# Altium schematic sheet LEDs.SchDoc
size A4; Organization: TU Darmstadt; Address1: IES; Address2: Merckstraße 25; Address3: 64283 Darmstadt; Address4: Germany
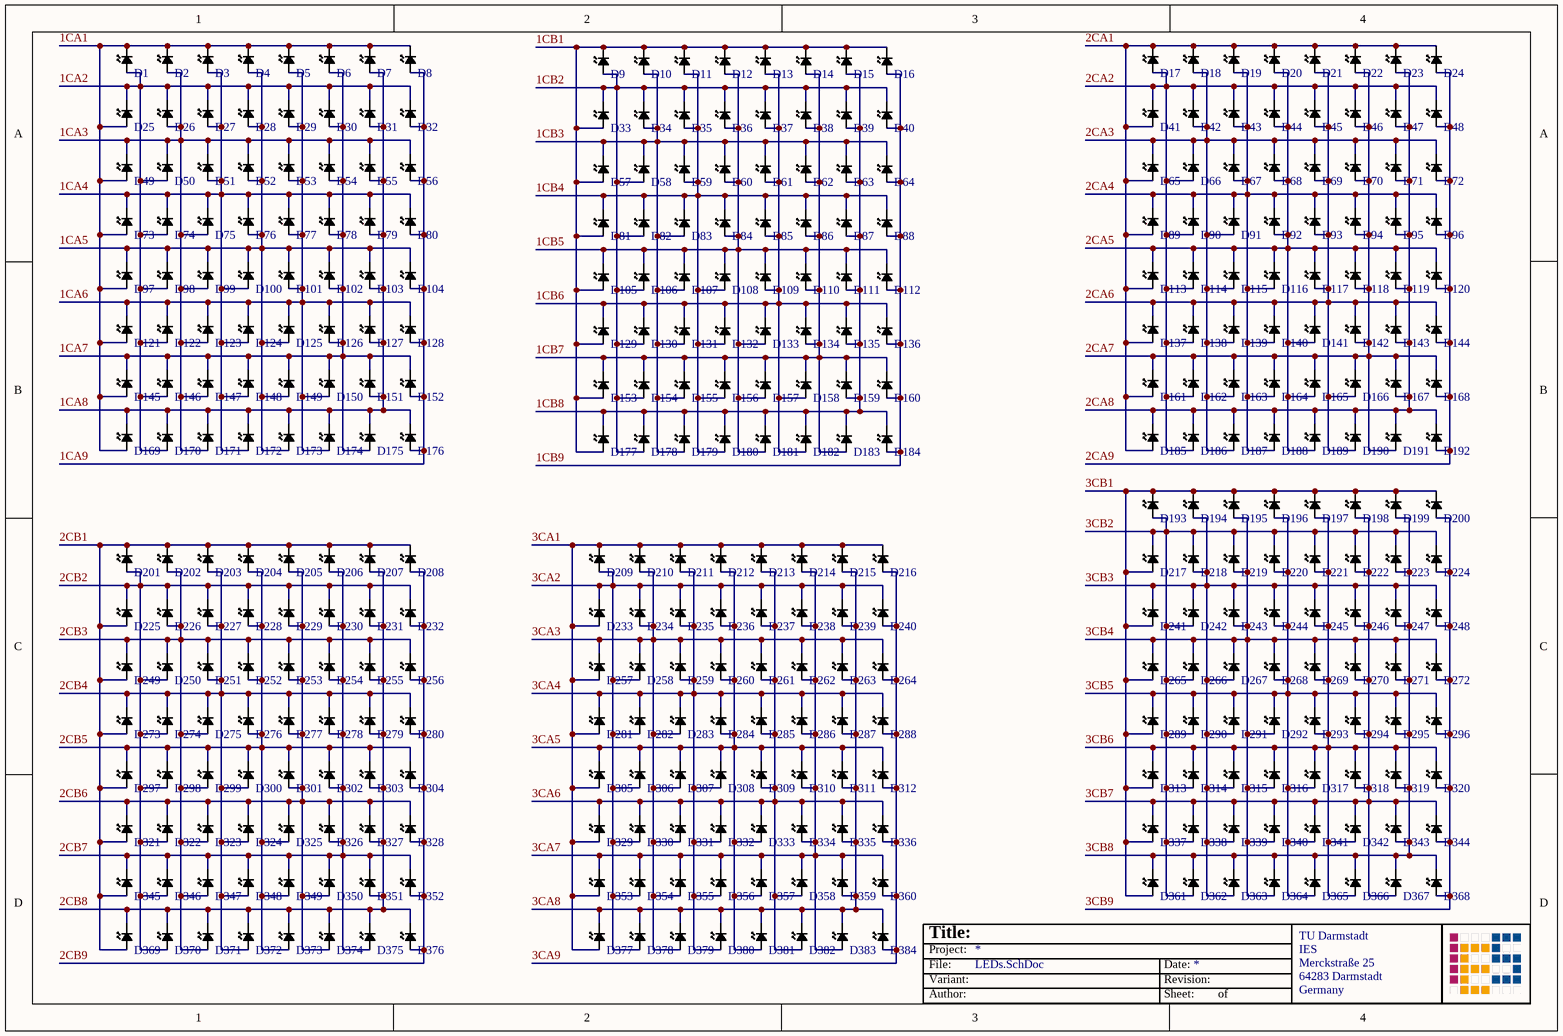
[diagram p0: LEDs.SchDoc]

## Parts
D1  SMD LED  [SML-D12x1]  (value not drawn)
D2  SMD LED  [SML-D12x1]  (value not drawn)
D3  SMD LED  [SML-D12x1]  (value not drawn)
D4  SMD LED  [SML-D12x1]  (value not drawn)
D5  SMD LED  [SML-D12x1]  (value not drawn)
D6  SMD LED  [SML-D12x1]  (value not drawn)
D7  SMD LED  [SML-D12x1]  (value not drawn)
D8  SMD LED  [SML-D12x1]  (value not drawn)
D9  SMD LED  [SML-D12x1]  (value not drawn)
D10  SMD LED  [SML-D12x1]  (value not drawn)
D11  SMD LED  [SML-D12x1]  (value not drawn)
D12  SMD LED  [SML-D12x1]  (value not drawn)
D13  SMD LED  [SML-D12x1]  (value not drawn)
D14  SMD LED  [SML-D12x1]  (value not drawn)
D15  SMD LED  [SML-D12x1]  (value not drawn)
D16  SMD LED  [SML-D12x1]  (value not drawn)
D17  SMD LED  [SML-D12x1]  (value not drawn)
D18  SMD LED  [SML-D12x1]  (value not drawn)
D19  SMD LED  [SML-D12x1]  (value not drawn)
D20  SMD LED  [SML-D12x1]  (value not drawn)
D21  SMD LED  [SML-D12x1]  (value not drawn)
D22  SMD LED  [SML-D12x1]  (value not drawn)
D23  SMD LED  [SML-D12x1]  (value not drawn)
D24  SMD LED  [SML-D12x1]  (value not drawn)
D25  SMD LED  [SML-D12x1]  (value not drawn)
D26  SMD LED  [SML-D12x1]  (value not drawn)
D27  SMD LED  [SML-D12x1]  (value not drawn)
D28  SMD LED  [SML-D12x1]  (value not drawn)
D29  SMD LED  [SML-D12x1]  (value not drawn)
D30  SMD LED  [SML-D12x1]  (value not drawn)
D31  SMD LED  [SML-D12x1]  (value not drawn)
D32  SMD LED  [SML-D12x1]  (value not drawn)
D33  SMD LED  [SML-D12x1]  (value not drawn)
D34  SMD LED  [SML-D12x1]  (value not drawn)
D35  SMD LED  [SML-D12x1]  (value not drawn)
D36  SMD LED  [SML-D12x1]  (value not drawn)
D37  SMD LED  [SML-D12x1]  (value not drawn)
D38  SMD LED  [SML-D12x1]  (value not drawn)
D39  SMD LED  [SML-D12x1]  (value not drawn)
D40  SMD LED  [SML-D12x1]  (value not drawn)
D41  SMD LED  [SML-D12x1]  (value not drawn)
D42  SMD LED  [SML-D12x1]  (value not drawn)
D43  SMD LED  [SML-D12x1]  (value not drawn)
D44  SMD LED  [SML-D12x1]  (value not drawn)
D45  SMD LED  [SML-D12x1]  (value not drawn)
D46  SMD LED  [SML-D12x1]  (value not drawn)
D47  SMD LED  [SML-D12x1]  (value not drawn)
D48  SMD LED  [SML-D12x1]  (value not drawn)
D49  SMD LED  [SML-D12x1]  (value not drawn)
D50  SMD LED  [SML-D12x1]  (value not drawn)
D51  SMD LED  [SML-D12x1]  (value not drawn)
D52  SMD LED  [SML-D12x1]  (value not drawn)
D53  SMD LED  [SML-D12x1]  (value not drawn)
D54  SMD LED  [SML-D12x1]  (value not drawn)
D55  SMD LED  [SML-D12x1]  (value not drawn)
D56  SMD LED  [SML-D12x1]  (value not drawn)
D57  SMD LED  [SML-D12x1]  (value not drawn)
D58  SMD LED  [SML-D12x1]  (value not drawn)
D59  SMD LED  [SML-D12x1]  (value not drawn)
D60  SMD LED  [SML-D12x1]  (value not drawn)
D61  SMD LED  [SML-D12x1]  (value not drawn)
D62  SMD LED  [SML-D12x1]  (value not drawn)
D63  SMD LED  [SML-D12x1]  (value not drawn)
D64  SMD LED  [SML-D12x1]  (value not drawn)
D65  SMD LED  [SML-D12x1]  (value not drawn)
D66  SMD LED  [SML-D12x1]  (value not drawn)
D67  SMD LED  [SML-D12x1]  (value not drawn)
D68  SMD LED  [SML-D12x1]  (value not drawn)
D69  SMD LED  [SML-D12x1]  (value not drawn)
D70  SMD LED  [SML-D12x1]  (value not drawn)
D71  SMD LED  [SML-D12x1]  (value not drawn)
D72  SMD LED  [SML-D12x1]  (value not drawn)
D73  SMD LED  [SML-D12x1]  (value not drawn)
D74  SMD LED  [SML-D12x1]  (value not drawn)
D75  SMD LED  [SML-D12x1]  (value not drawn)
D76  SMD LED  [SML-D12x1]  (value not drawn)
D77  SMD LED  [SML-D12x1]  (value not drawn)
D78  SMD LED  [SML-D12x1]  (value not drawn)
D79  SMD LED  [SML-D12x1]  (value not drawn)
D80  SMD LED  [SML-D12x1]  (value not drawn)
D81  SMD LED  [SML-D12x1]  (value not drawn)
D82  SMD LED  [SML-D12x1]  (value not drawn)
D83  SMD LED  [SML-D12x1]  (value not drawn)
D84  SMD LED  [SML-D12x1]  (value not drawn)
D85  SMD LED  [SML-D12x1]  (value not drawn)
D86  SMD LED  [SML-D12x1]  (value not drawn)
D87  SMD LED  [SML-D12x1]  (value not drawn)
D88  SMD LED  [SML-D12x1]  (value not drawn)
D89  SMD LED  [SML-D12x1]  (value not drawn)
D90  SMD LED  [SML-D12x1]  (value not drawn)
D91  SMD LED  [SML-D12x1]  (value not drawn)
D92  SMD LED  [SML-D12x1]  (value not drawn)
D93  SMD LED  [SML-D12x1]  (value not drawn)
D94  SMD LED  [SML-D12x1]  (value not drawn)
D95  SMD LED  [SML-D12x1]  (value not drawn)
D96  SMD LED  [SML-D12x1]  (value not drawn)
D97  SMD LED  [SML-D12x1]  (value not drawn)
D98  SMD LED  [SML-D12x1]  (value not drawn)
D99  SMD LED  [SML-D12x1]  (value not drawn)
D100  SMD LED  [SML-D12x1]  (value not drawn)
D101  SMD LED  [SML-D12x1]  (value not drawn)
D102  SMD LED  [SML-D12x1]  (value not drawn)
D103  SMD LED  [SML-D12x1]  (value not drawn)
D104  SMD LED  [SML-D12x1]  (value not drawn)
D105  SMD LED  [SML-D12x1]  (value not drawn)
D106  SMD LED  [SML-D12x1]  (value not drawn)
D107  SMD LED  [SML-D12x1]  (value not drawn)
D108  SMD LED  [SML-D12x1]  (value not drawn)
D109  SMD LED  [SML-D12x1]  (value not drawn)
D110  SMD LED  [SML-D12x1]  (value not drawn)
D111  SMD LED  [SML-D12x1]  (value not drawn)
D112  SMD LED  [SML-D12x1]  (value not drawn)
D113  SMD LED  [SML-D12x1]  (value not drawn)
D114  SMD LED  [SML-D12x1]  (value not drawn)
D115  SMD LED  [SML-D12x1]  (value not drawn)
D116  SMD LED  [SML-D12x1]  (value not drawn)
D117  SMD LED  [SML-D12x1]  (value not drawn)
D118  SMD LED  [SML-D12x1]  (value not drawn)
D119  SMD LED  [SML-D12x1]  (value not drawn)
D120  SMD LED  [SML-D12x1]  (value not drawn)
D121  SMD LED  [SML-D12x1]  (value not drawn)
D122  SMD LED  [SML-D12x1]  (value not drawn)
D123  SMD LED  [SML-D12x1]  (value not drawn)
D124  SMD LED  [SML-D12x1]  (value not drawn)
D125  SMD LED  [SML-D12x1]  (value not drawn)
D126  SMD LED  [SML-D12x1]  (value not drawn)
D127  SMD LED  [SML-D12x1]  (value not drawn)
D128  SMD LED  [SML-D12x1]  (value not drawn)
D129  SMD LED  [SML-D12x1]  (value not drawn)
D130  SMD LED  [SML-D12x1]  (value not drawn)
D131  SMD LED  [SML-D12x1]  (value not drawn)
D132  SMD LED  [SML-D12x1]  (value not drawn)
D133  SMD LED  [SML-D12x1]  (value not drawn)
D134  SMD LED  [SML-D12x1]  (value not drawn)
D135  SMD LED  [SML-D12x1]  (value not drawn)
D136  SMD LED  [SML-D12x1]  (value not drawn)
D137  SMD LED  [SML-D12x1]  (value not drawn)
D138  SMD LED  [SML-D12x1]  (value not drawn)
D139  SMD LED  [SML-D12x1]  (value not drawn)
D140  SMD LED  [SML-D12x1]  (value not drawn)
D141  SMD LED  [SML-D12x1]  (value not drawn)
D142  SMD LED  [SML-D12x1]  (value not drawn)
D143  SMD LED  [SML-D12x1]  (value not drawn)
D144  SMD LED  [SML-D12x1]  (value not drawn)
D145  SMD LED  [SML-D12x1]  (value not drawn)
D146  SMD LED  [SML-D12x1]  (value not drawn)
D147  SMD LED  [SML-D12x1]  (value not drawn)
D148  SMD LED  [SML-D12x1]  (value not drawn)
D149  SMD LED  [SML-D12x1]  (value not drawn)
D150  SMD LED  [SML-D12x1]  (value not drawn)
D151  SMD LED  [SML-D12x1]  (value not drawn)
D152  SMD LED  [SML-D12x1]  (value not drawn)
D153  SMD LED  [SML-D12x1]  (value not drawn)
D154  SMD LED  [SML-D12x1]  (value not drawn)
D155  SMD LED  [SML-D12x1]  (value not drawn)
D156  SMD LED  [SML-D12x1]  (value not drawn)
D157  SMD LED  [SML-D12x1]  (value not drawn)
D158  SMD LED  [SML-D12x1]  (value not drawn)
D159  SMD LED  [SML-D12x1]  (value not drawn)
D160  SMD LED  [SML-D12x1]  (value not drawn)
D161  SMD LED  [SML-D12x1]  (value not drawn)
D162  SMD LED  [SML-D12x1]  (value not drawn)
D163  SMD LED  [SML-D12x1]  (value not drawn)
D164  SMD LED  [SML-D12x1]  (value not drawn)
D165  SMD LED  [SML-D12x1]  (value not drawn)
D166  SMD LED  [SML-D12x1]  (value not drawn)
D167  SMD LED  [SML-D12x1]  (value not drawn)
D168  SMD LED  [SML-D12x1]  (value not drawn)
D169  SMD LED  [SML-D12x1]  (value not drawn)
D170  SMD LED  [SML-D12x1]  (value not drawn)
D171  SMD LED  [SML-D12x1]  (value not drawn)
D172  SMD LED  [SML-D12x1]  (value not drawn)
D173  SMD LED  [SML-D12x1]  (value not drawn)
D174  SMD LED  [SML-D12x1]  (value not drawn)
D175  SMD LED  [SML-D12x1]  (value not drawn)
D176  SMD LED  [SML-D12x1]  (value not drawn)
D177  SMD LED  [SML-D12x1]  (value not drawn)
D178  SMD LED  [SML-D12x1]  (value not drawn)
D179  SMD LED  [SML-D12x1]  (value not drawn)
D180  SMD LED  [SML-D12x1]  (value not drawn)
D181  SMD LED  [SML-D12x1]  (value not drawn)
D182  SMD LED  [SML-D12x1]  (value not drawn)
D183  SMD LED  [SML-D12x1]  (value not drawn)
D184  SMD LED  [SML-D12x1]  (value not drawn)
D185  SMD LED  [SML-D12x1]  (value not drawn)
D186  SMD LED  [SML-D12x1]  (value not drawn)
D187  SMD LED  [SML-D12x1]  (value not drawn)
D188  SMD LED  [SML-D12x1]  (value not drawn)
D189  SMD LED  [SML-D12x1]  (value not drawn)
D190  SMD LED  [SML-D12x1]  (value not drawn)
D191  SMD LED  [SML-D12x1]  (value not drawn)
D192  SMD LED  [SML-D12x1]  (value not drawn)
D193  SMD LED  [SML-D12x1]  (value not drawn)
D194  SMD LED  [SML-D12x1]  (value not drawn)
D195  SMD LED  [SML-D12x1]  (value not drawn)
D196  SMD LED  [SML-D12x1]  (value not drawn)
D197  SMD LED  [SML-D12x1]  (value not drawn)
D198  SMD LED  [SML-D12x1]  (value not drawn)
D199  SMD LED  [SML-D12x1]  (value not drawn)
D200  SMD LED  [SML-D12x1]  (value not drawn)
D201  SMD LED  [SML-D12x1]  (value not drawn)
D202  SMD LED  [SML-D12x1]  (value not drawn)
D203  SMD LED  [SML-D12x1]  (value not drawn)
D204  SMD LED  [SML-D12x1]  (value not drawn)
D205  SMD LED  [SML-D12x1]  (value not drawn)
D206  SMD LED  [SML-D12x1]  (value not drawn)
D207  SMD LED  [SML-D12x1]  (value not drawn)
D208  SMD LED  [SML-D12x1]  (value not drawn)
D209  SMD LED  [SML-D12x1]  (value not drawn)
D210  SMD LED  [SML-D12x1]  (value not drawn)
D211  SMD LED  [SML-D12x1]  (value not drawn)
D212  SMD LED  [SML-D12x1]  (value not drawn)
D213  SMD LED  [SML-D12x1]  (value not drawn)
D214  SMD LED  [SML-D12x1]  (value not drawn)
D215  SMD LED  [SML-D12x1]  (value not drawn)
D216  SMD LED  [SML-D12x1]  (value not drawn)
D217  SMD LED  [SML-D12x1]  (value not drawn)
D218  SMD LED  [SML-D12x1]  (value not drawn)
D219  SMD LED  [SML-D12x1]  (value not drawn)
D220  SMD LED  [SML-D12x1]  (value not drawn)
D221  SMD LED  [SML-D12x1]  (value not drawn)
D222  SMD LED  [SML-D12x1]  (value not drawn)
D223  SMD LED  [SML-D12x1]  (value not drawn)
D224  SMD LED  [SML-D12x1]  (value not drawn)
D225  SMD LED  [SML-D12x1]  (value not drawn)
D226  SMD LED  [SML-D12x1]  (value not drawn)
D227  SMD LED  [SML-D12x1]  (value not drawn)
D228  SMD LED  [SML-D12x1]  (value not drawn)
D229  SMD LED  [SML-D12x1]  (value not drawn)
D230  SMD LED  [SML-D12x1]  (value not drawn)
D231  SMD LED  [SML-D12x1]  (value not drawn)
D232  SMD LED  [SML-D12x1]  (value not drawn)
D233  SMD LED  [SML-D12x1]  (value not drawn)
D234  SMD LED  [SML-D12x1]  (value not drawn)
D235  SMD LED  [SML-D12x1]  (value not drawn)
D236  SMD LED  [SML-D12x1]  (value not drawn)
D237  SMD LED  [SML-D12x1]  (value not drawn)
D238  SMD LED  [SML-D12x1]  (value not drawn)
D239  SMD LED  [SML-D12x1]  (value not drawn)
D240  SMD LED  [SML-D12x1]  (value not drawn)
D241  SMD LED  [SML-D12x1]  (value not drawn)
D242  SMD LED  [SML-D12x1]  (value not drawn)
D243  SMD LED  [SML-D12x1]  (value not drawn)
D244  SMD LED  [SML-D12x1]  (value not drawn)
D245  SMD LED  [SML-D12x1]  (value not drawn)
D246  SMD LED  [SML-D12x1]  (value not drawn)
D247  SMD LED  [SML-D12x1]  (value not drawn)
D248  SMD LED  [SML-D12x1]  (value not drawn)
D249  SMD LED  [SML-D12x1]  (value not drawn)
D250  SMD LED  [SML-D12x1]  (value not drawn)
D251  SMD LED  [SML-D12x1]  (value not drawn)
D252  SMD LED  [SML-D12x1]  (value not drawn)
D253  SMD LED  [SML-D12x1]  (value not drawn)
D254  SMD LED  [SML-D12x1]  (value not drawn)
D255  SMD LED  [SML-D12x1]  (value not drawn)
D256  SMD LED  [SML-D12x1]  (value not drawn)
D257  SMD LED  [SML-D12x1]  (value not drawn)
D258  SMD LED  [SML-D12x1]  (value not drawn)
D259  SMD LED  [SML-D12x1]  (value not drawn)
D260  SMD LED  [SML-D12x1]  (value not drawn)
D261  SMD LED  [SML-D12x1]  (value not drawn)
D262  SMD LED  [SML-D12x1]  (value not drawn)
D263  SMD LED  [SML-D12x1]  (value not drawn)
D264  SMD LED  [SML-D12x1]  (value not drawn)
D265  SMD LED  [SML-D12x1]  (value not drawn)
D266  SMD LED  [SML-D12x1]  (value not drawn)
D267  SMD LED  [SML-D12x1]  (value not drawn)
D268  SMD LED  [SML-D12x1]  (value not drawn)
D269  SMD LED  [SML-D12x1]  (value not drawn)
D270  SMD LED  [SML-D12x1]  (value not drawn)
D271  SMD LED  [SML-D12x1]  (value not drawn)
D272  SMD LED  [SML-D12x1]  (value not drawn)
D273  SMD LED  [SML-D12x1]  (value not drawn)
D274  SMD LED  [SML-D12x1]  (value not drawn)
D275  SMD LED  [SML-D12x1]  (value not drawn)
D276  SMD LED  [SML-D12x1]  (value not drawn)
D277  SMD LED  [SML-D12x1]  (value not drawn)
D278  SMD LED  [SML-D12x1]  (value not drawn)
D279  SMD LED  [SML-D12x1]  (value not drawn)
D280  SMD LED  [SML-D12x1]  (value not drawn)
D281  SMD LED  [SML-D12x1]  (value not drawn)
D282  SMD LED  [SML-D12x1]  (value not drawn)
D283  SMD LED  [SML-D12x1]  (value not drawn)
D284  SMD LED  [SML-D12x1]  (value not drawn)
D285  SMD LED  [SML-D12x1]  (value not drawn)
D286  SMD LED  [SML-D12x1]  (value not drawn)
D287  SMD LED  [SML-D12x1]  (value not drawn)
D288  SMD LED  [SML-D12x1]  (value not drawn)
D289  SMD LED  [SML-D12x1]  (value not drawn)
D290  SMD LED  [SML-D12x1]  (value not drawn)
D291  SMD LED  [SML-D12x1]  (value not drawn)
D292  SMD LED  [SML-D12x1]  (value not drawn)
D293  SMD LED  [SML-D12x1]  (value not drawn)
D294  SMD LED  [SML-D12x1]  (value not drawn)
D295  SMD LED  [SML-D12x1]  (value not drawn)
D296  SMD LED  [SML-D12x1]  (value not drawn)
D297  SMD LED  [SML-D12x1]  (value not drawn)
D298  SMD LED  [SML-D12x1]  (value not drawn)
D299  SMD LED  [SML-D12x1]  (value not drawn)
D300  SMD LED  [SML-D12x1]  (value not drawn)
D301  SMD LED  [SML-D12x1]  (value not drawn)
D302  SMD LED  [SML-D12x1]  (value not drawn)
D303  SMD LED  [SML-D12x1]  (value not drawn)
D304  SMD LED  [SML-D12x1]  (value not drawn)
D305  SMD LED  [SML-D12x1]  (value not drawn)
D306  SMD LED  [SML-D12x1]  (value not drawn)
D307  SMD LED  [SML-D12x1]  (value not drawn)
D308  SMD LED  [SML-D12x1]  (value not drawn)
D309  SMD LED  [SML-D12x1]  (value not drawn)
D310  SMD LED  [SML-D12x1]  (value not drawn)
D311  SMD LED  [SML-D12x1]  (value not drawn)
D312  SMD LED  [SML-D12x1]  (value not drawn)
D313  SMD LED  [SML-D12x1]  (value not drawn)
D314  SMD LED  [SML-D12x1]  (value not drawn)
D315  SMD LED  [SML-D12x1]  (value not drawn)
D316  SMD LED  [SML-D12x1]  (value not drawn)
D317  SMD LED  [SML-D12x1]  (value not drawn)
D318  SMD LED  [SML-D12x1]  (value not drawn)
D319  SMD LED  [SML-D12x1]  (value not drawn)
D320  SMD LED  [SML-D12x1]  (value not drawn)
D321  SMD LED  [SML-D12x1]  (value not drawn)
D322  SMD LED  [SML-D12x1]  (value not drawn)
D323  SMD LED  [SML-D12x1]  (value not drawn)
D324  SMD LED  [SML-D12x1]  (value not drawn)
D325  SMD LED  [SML-D12x1]  (value not drawn)
D326  SMD LED  [SML-D12x1]  (value not drawn)
D327  SMD LED  [SML-D12x1]  (value not drawn)
D328  SMD LED  [SML-D12x1]  (value not drawn)
D329  SMD LED  [SML-D12x1]  (value not drawn)
D330  SMD LED  [SML-D12x1]  (value not drawn)
D331  SMD LED  [SML-D12x1]  (value not drawn)
D332  SMD LED  [SML-D12x1]  (value not drawn)
D333  SMD LED  [SML-D12x1]  (value not drawn)
D334  SMD LED  [SML-D12x1]  (value not drawn)
D335  SMD LED  [SML-D12x1]  (value not drawn)
D336  SMD LED  [SML-D12x1]  (value not drawn)
D337  SMD LED  [SML-D12x1]  (value not drawn)
D338  SMD LED  [SML-D12x1]  (value not drawn)
D339  SMD LED  [SML-D12x1]  (value not drawn)
D340  SMD LED  [SML-D12x1]  (value not drawn)
D341  SMD LED  [SML-D12x1]  (value not drawn)
D342  SMD LED  [SML-D12x1]  (value not drawn)
D343  SMD LED  [SML-D12x1]  (value not drawn)
D344  SMD LED  [SML-D12x1]  (value not drawn)
D345  SMD LED  [SML-D12x1]  (value not drawn)
D346  SMD LED  [SML-D12x1]  (value not drawn)
D347  SMD LED  [SML-D12x1]  (value not drawn)
D348  SMD LED  [SML-D12x1]  (value not drawn)
D349  SMD LED  [SML-D12x1]  (value not drawn)
D350  SMD LED  [SML-D12x1]  (value not drawn)
D351  SMD LED  [SML-D12x1]  (value not drawn)
D352  SMD LED  [SML-D12x1]  (value not drawn)
D353  SMD LED  [SML-D12x1]  (value not drawn)
D354  SMD LED  [SML-D12x1]  (value not drawn)
D355  SMD LED  [SML-D12x1]  (value not drawn)
D356  SMD LED  [SML-D12x1]  (value not drawn)
D357  SMD LED  [SML-D12x1]  (value not drawn)
D358  SMD LED  [SML-D12x1]  (value not drawn)
D359  SMD LED  [SML-D12x1]  (value not drawn)
D360  SMD LED  [SML-D12x1]  (value not drawn)
D361  SMD LED  [SML-D12x1]  (value not drawn)
D362  SMD LED  [SML-D12x1]  (value not drawn)
D363  SMD LED  [SML-D12x1]  (value not drawn)
D364  SMD LED  [SML-D12x1]  (value not drawn)
D365  SMD LED  [SML-D12x1]  (value not drawn)
D366  SMD LED  [SML-D12x1]  (value not drawn)
D367  SMD LED  [SML-D12x1]  (value not drawn)
D368  SMD LED  [SML-D12x1]  (value not drawn)
D369  SMD LED  [SML-D12x1]  (value not drawn)
D370  SMD LED  [SML-D12x1]  (value not drawn)
D371  SMD LED  [SML-D12x1]  (value not drawn)
D372  SMD LED  [SML-D12x1]  (value not drawn)
D373  SMD LED  [SML-D12x1]  (value not drawn)
D374  SMD LED  [SML-D12x1]  (value not drawn)
D375  SMD LED  [SML-D12x1]  (value not drawn)
D376  SMD LED  [SML-D12x1]  (value not drawn)
D377  SMD LED  [SML-D12x1]  (value not drawn)
D378  SMD LED  [SML-D12x1]  (value not drawn)
D379  SMD LED  [SML-D12x1]  (value not drawn)
D380  SMD LED  [SML-D12x1]  (value not drawn)
D381  SMD LED  [SML-D12x1]  (value not drawn)
D382  SMD LED  [SML-D12x1]  (value not drawn)
D383  SMD LED  [SML-D12x1]  (value not drawn)
D384  SMD LED  [SML-D12x1]  (value not drawn)

## Nets
1CA1: D1.1 D2.1 D3.1 D4.1 D5.1 D6.1 D7.1 D8.1 D25.2 D49.2 D73.2 D97.2 D121.2 D145.2 D169.2
1CA2: D1.2 D25.1 D26.1 D27.1 D28.1 D29.1 D30.1 D31.1 D32.1 D50.2 D74.2 D98.2 D122.2 D146.2 D170.2
1CA3: D2.2 D26.2 D49.1 D50.1 D51.1 D52.1 D53.1 D54.1 D55.1 D56.1 D75.2 D99.2 D123.2 D147.2 D171.2
1CA4: D3.2 D27.2 D51.2 D73.1 D74.1 D75.1 D76.1 D77.1 D78.1 D79.1 D80.1 D100.2 D124.2 D148.2 D172.2
1CA5: D4.2 D28.2 D52.2 D76.2 D97.1 D98.1 D99.1 D100.1 D101.1 D102.1 D103.1 D104.1 D125.2 D149.2 D173.2
1CA6: D5.2 D29.2 D53.2 D77.2 D101.2 D121.1 D122.1 D123.1 D124.1 D125.1 D126.1 D127.1 D128.1 D150.2 D174.2
1CA7: D6.2 D30.2 D54.2 D78.2 D102.2 D126.2 D145.1 D146.1 D147.1 D148.1 D149.1 D150.1 D151.1 D152.1 D175.2
1CA8: D7.2 D31.2 D55.2 D79.2 D103.2 D127.2 D151.2 D169.1 D170.1 D171.1 D172.1 D173.1 D174.1 D175.1 D176.1
1CA9: D8.2 D32.2 D56.2 D80.2 D104.2 D128.2 D152.2 D176.2
1CB1: D9.1 D10.1 D11.1 D12.1 D13.1 D14.1 D15.1 D16.1 D33.2 D57.2 D81.2 D105.2 D129.2 D153.2 D177.2
1CB2: D9.2 D33.1 D34.1 D35.1 D36.1 D37.1 D38.1 D39.1 D40.1 D58.2 D82.2 D106.2 D130.2 D154.2 D178.2
1CB3: D10.2 D34.2 D57.1 D58.1 D59.1 D60.1 D61.1 D62.1 D63.1 D64.1 D83.2 D107.2 D131.2 D155.2 D179.2
1CB4: D11.2 D35.2 D59.2 D81.1 D82.1 D83.1 D84.1 D85.1 D86.1 D87.1 D88.1 D108.2 D132.2 D156.2 D180.2
1CB5: D12.2 D36.2 D60.2 D84.2 D105.1 D106.1 D107.1 D108.1 D109.1 D110.1 D111.1 D112.1 D133.2 D157.2 D181.2
1CB6: D13.2 D37.2 D61.2 D85.2 D109.2 D129.1 D130.1 D131.1 D132.1 D133.1 D134.1 D135.1 D136.1 D158.2 D182.2
1CB7: D14.2 D38.2 D62.2 D86.2 D110.2 D134.2 D153.1 D154.1 D155.1 D156.1 D157.1 D158.1 D159.1 D160.1 D183.2
1CB8: D15.2 D39.2 D63.2 D87.2 D111.2 D135.2 D159.2 D177.1 D178.1 D179.1 D180.1 D181.1 D182.1 D183.1 D184.1
1CB9: D16.2 D40.2 D64.2 D88.2 D112.2 D136.2 D160.2 D184.2
2CA1: D17.1 D18.1 D19.1 D20.1 D21.1 D22.1 D23.1 D24.1 D41.2 D65.2 D89.2 D113.2 D137.2 D161.2 D185.2
2CA2: D17.2 D41.1 D42.1 D43.1 D44.1 D45.1 D46.1 D47.1 D48.1 D66.2 D90.2 D114.2 D138.2 D162.2 D186.2
2CA3: D18.2 D42.2 D65.1 D66.1 D67.1 D68.1 D69.1 D70.1 D71.1 D72.1 D91.2 D115.2 D139.2 D163.2 D187.2
2CA4: D19.2 D43.2 D67.2 D89.1 D90.1 D91.1 D92.1 D93.1 D94.1 D95.1 D96.1 D116.2 D140.2 D164.2 D188.2
2CA5: D20.2 D44.2 D68.2 D92.2 D113.1 D114.1 D115.1 D116.1 D117.1 D118.1 D119.1 D120.1 D141.2 D165.2 D189.2
2CA6: D21.2 D45.2 D69.2 D93.2 D117.2 D137.1 D138.1 D139.1 D140.1 D141.1 D142.1 D143.1 D144.1 D166.2 D190.2
2CA7: D22.2 D46.2 D70.2 D94.2 D118.2 D142.2 D161.1 D162.1 D163.1 D164.1 D165.1 D166.1 D167.1 D168.1 D191.2
2CA8: D23.2 D47.2 D71.2 D95.2 D119.2 D143.2 D167.2 D185.1 D186.1 D187.1 D188.1 D189.1 D190.1 D191.1 D192.1
2CA9: D24.2 D48.2 D72.2 D96.2 D120.2 D144.2 D168.2 D192.2
2CB1: D201.1 D202.1 D203.1 D204.1 D205.1 D206.1 D207.1 D208.1 D225.2 D249.2 D273.2 D297.2 D321.2 D345.2 D369.2
2CB2: D201.2 D225.1 D226.1 D227.1 D228.1 D229.1 D230.1 D231.1 D232.1 D250.2 D274.2 D298.2 D322.2 D346.2 D370.2
2CB3: D202.2 D226.2 D249.1 D250.1 D251.1 D252.1 D253.1 D254.1 D255.1 D256.1 D275.2 D299.2 D323.2 D347.2 D371.2
2CB4: D203.2 D227.2 D251.2 D273.1 D274.1 D275.1 D276.1 D277.1 D278.1 D279.1 D280.1 D300.2 D324.2 D348.2 D372.2
2CB5: D204.2 D228.2 D252.2 D276.2 D297.1 D298.1 D299.1 D300.1 D301.1 D302.1 D303.1 D304.1 D325.2 D349.2 D373.2
2CB6: D205.2 D229.2 D253.2 D277.2 D301.2 D321.1 D322.1 D323.1 D324.1 D325.1 D326.1 D327.1 D328.1 D350.2 D374.2
2CB7: D206.2 D230.2 D254.2 D278.2 D302.2 D326.2 D345.1 D346.1 D347.1 D348.1 D349.1 D350.1 D351.1 D352.1 D375.2
2CB8: D207.2 D231.2 D255.2 D279.2 D303.2 D327.2 D351.2 D369.1 D370.1 D371.1 D372.1 D373.1 D374.1 D375.1 D376.1
2CB9: D208.2 D232.2 D256.2 D280.2 D304.2 D328.2 D352.2 D376.2
3CA1: D209.1 D210.1 D211.1 D212.1 D213.1 D214.1 D215.1 D216.1 D233.2 D257.2 D281.2 D305.2 D329.2 D353.2 D377.2
3CA2: D209.2 D233.1 D234.1 D235.1 D236.1 D237.1 D238.1 D239.1 D240.1 D258.2 D282.2 D306.2 D330.2 D354.2 D378.2
3CA3: D210.2 D234.2 D257.1 D258.1 D259.1 D260.1 D261.1 D262.1 D263.1 D264.1 D283.2 D307.2 D331.2 D355.2 D379.2
3CA4: D211.2 D235.2 D259.2 D281.1 D282.1 D283.1 D284.1 D285.1 D286.1 D287.1 D288.1 D308.2 D332.2 D356.2 D380.2
3CA5: D212.2 D236.2 D260.2 D284.2 D305.1 D306.1 D307.1 D308.1 D309.1 D310.1 D311.1 D312.1 D333.2 D357.2 D381.2
3CA6: D213.2 D237.2 D261.2 D285.2 D309.2 D329.1 D330.1 D331.1 D332.1 D333.1 D334.1 D335.1 D336.1 D358.2 D382.2
3CA7: D214.2 D238.2 D262.2 D286.2 D310.2 D334.2 D353.1 D354.1 D355.1 D356.1 D357.1 D358.1 D359.1 D360.1 D383.2
3CA8: D215.2 D239.2 D263.2 D287.2 D311.2 D335.2 D359.2 D377.1 D378.1 D379.1 D380.1 D381.1 D382.1 D383.1 D384.1
3CA9: D216.2 D240.2 D264.2 D288.2 D312.2 D336.2 D360.2 D384.2
3CB1: D193.1 D194.1 D195.1 D196.1 D197.1 D198.1 D199.1 D200.1 D217.2 D241.2 D265.2 D289.2 D313.2 D337.2 D361.2
3CB2: D193.2 D217.1 D218.1 D219.1 D220.1 D221.1 D222.1 D223.1 D224.1 D242.2 D266.2 D290.2 D314.2 D338.2 D362.2
3CB3: D194.2 D218.2 D241.1 D242.1 D243.1 D244.1 D245.1 D246.1 D247.1 D248.1 D267.2 D291.2 D315.2 D339.2 D363.2
3CB4: D195.2 D219.2 D243.2 D265.1 D266.1 D267.1 D268.1 D269.1 D270.1 D271.1 D272.1 D292.2 D316.2 D340.2 D364.2
3CB5: D196.2 D220.2 D244.2 D268.2 D289.1 D290.1 D291.1 D292.1 D293.1 D294.1 D295.1 D296.1 D317.2 D341.2 D365.2
3CB6: D197.2 D221.2 D245.2 D269.2 D293.2 D313.1 D314.1 D315.1 D316.1 D317.1 D318.1 D319.1 D320.1 D342.2 D366.2
3CB7: D198.2 D222.2 D246.2 D270.2 D294.2 D318.2 D337.1 D338.1 D339.1 D340.1 D341.1 D342.1 D343.1 D344.1 D367.2
3CB8: D199.2 D223.2 D247.2 D271.2 D295.2 D319.2 D343.2 D361.1 D362.1 D363.1 D364.1 D365.1 D366.1 D367.1 D368.1
3CB9: D200.2 D224.2 D248.2 D272.2 D296.2 D320.2 D344.2 D368.2

## Notes on the sheet
- Title:
- File:
- Project:
- Variant:
- Date:
- Revision:
- Author:
- Sheet:
- of

## Library data of the parts
D1-D384 = SML-D12U1WT86: LED RED DIFFUSED 1608 SMD; Manufacturer: Rohm; Lens Color: White; Luminous Intensity: 63mcd; Test Current: 20mA; Dominant Wavelength: 620nm; Forward Voltage: 2.2V; Supplier 1: Digi-Key; Manufacturer Part Number: SML-D12U1WT86; Stock 1: 91784; Pricing 1: 1 = 0,22000, 10 = 0,16200, 25 = 0,11920, 100 = 0,08530, 250 = 0,05796, 500 = 0,05116, 1000 = 0,04007 (USD); RoHS: Yes; Mount: Surface Mount; Case/Package: 0603; Color: Red; Case Code (Metric): 1608; Case Code (Imperial): 0603; Packaging: Tape and Reel; Lens Transparency: Diffused; Length: 1.6mm; Height: 0.65mm; Width: 0.8mm; Lead Free: Lead Free; ComponentLink1URL: https://www.rohm.com/datasheet/SML-D12U1W?src-supplier=Digi-Key; ComponentLink1Description: https://www.rohm.com/datasheet/SML-D12U1W?src-supplier=Digi-Key; Supplier Part Number 1: SML-D12U1WT86CT-ND